# Altium project C210 Rev_D.PrjPcb (part 3 of 5)

## Sheet C210_0006_Power.SchDoc: C210_0006_Power
size B; Date: 2/26/2021; CompanyName: U-blox; DrawnBy: EMOO; Engineer: EMOO; Organization: U-blox; Address1: 2601 25th St. SE; Address2: Salem, OR 97302; SheetNumber: 6; SheetTotal: 7; Website: www.u-blox.com; SheetSize: B; SheetTitle: C-210 Power
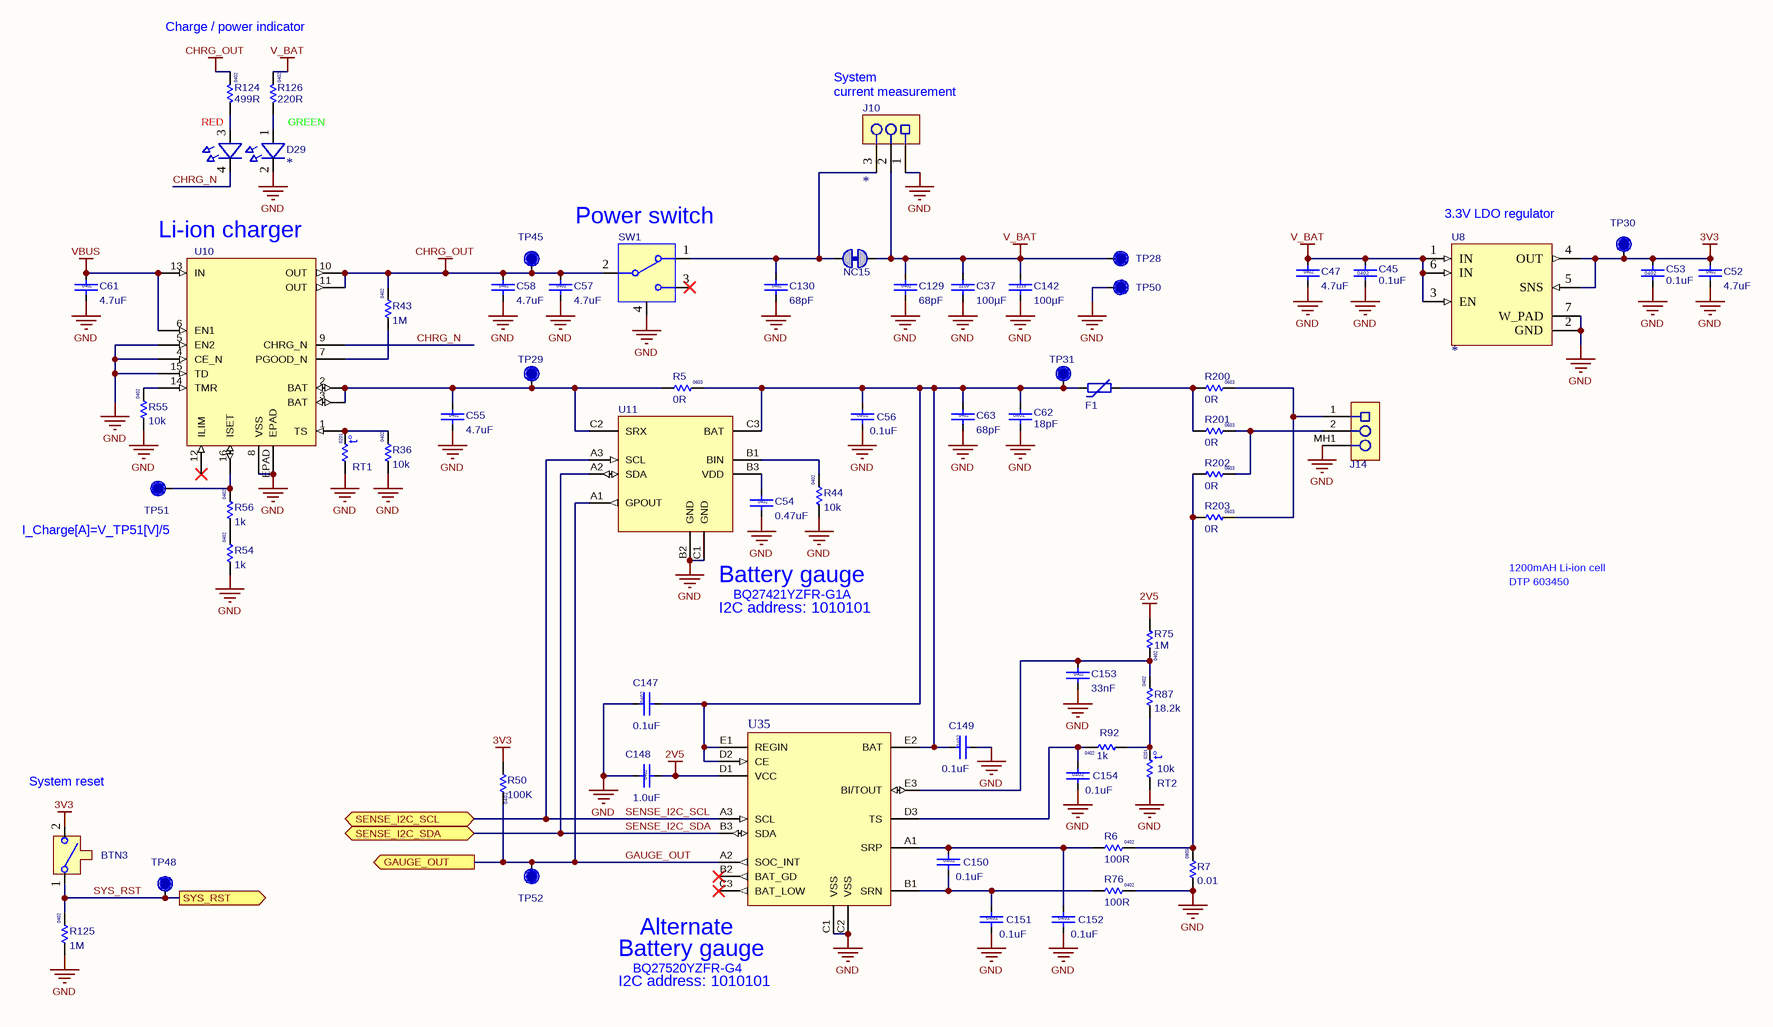
[diagram p3: C210_0006_Power.SchDoc]

### Parts
(Parts that share a designator on the sheet are numbered #1, #2 ... from top to bottom, then left to right.)
?#5  (no value)  (graphical)
BTN3  (no value)  [B3U-3000P]
C37  value 100µF  Size: 1210  [Cap 1210]
C45  value 0.1uF  Size: 0402  [Cap 0402 HD]  (hidden comment: 120-000160.1uF)
C47  value 4.7uF  Size: 0402  [Cap 0402 HD]
C52  value 4.7uF  Size: 0402  [Cap 0402 HD]
C53  value 0.1uF  Size: 0402  [Cap 0402 HD]  (hidden comment: 120-000160.1uF)
C54  value 0.47uF  Size: 0402  [Cap 0402 HD]
C55  value 4.7uF  Size: 0402  [Cap 0402 HD]
C56  value 0.1uF  Size: 0402  [Cap 0402 HD]  (hidden comment: 120-000160.1uF)
C57  value 4.7uF  Size: 0402  [Cap 0402 HD]
C58  value 4.7uF  Size: 0402  [Cap 0402 HD]
C61  value 4.7uF  Size: 0402  [Cap 0402 HD]
C62  value 18pF  Size: 0402  [Cap 0402 HD]
C63  value 68pF  Size: 0402  [Cap 0402 HD]
C129  value 68pF  Size: 0402  [Cap 0402 HD]
C130  value 68pF  Size: 0402  [Cap 0402 HD]
C142  value 100µF  Size: 1210  [Cap 1210]
C147  value 0.1uF  Size: 0402  [Cap 0402 HD]  (hidden comment: 120-000160.1uF)
C148  value 1.0uF  Size: 0402  [Cap 0402 HD]  (hidden comment: 120-000171.0uF)
C149  value 0.1uF  Size: 0402  [Cap 0402 HD]  (hidden comment: 120-000160.1uF)
C150  value 0.1uF  Size: 0402  [Cap 0402 HD]  (hidden comment: 120-000160.1uF)
C151  value 0.1uF  Size: 0402  [Cap 0402 HD]  (hidden comment: 120-000160.1uF)
C152  value 0.1uF  Size: 0402  [Cap 0402 HD]  (hidden comment: 120-000160.1uF)
C153  value 33nF  Size: 0402  [Cap 0402 HD]
C154  value 0.1uF  Size: 0402  [Cap 0402 HD]  (hidden comment: 120-000160.1uF)
D29  (no value)  [LED_4Pin_4213_RA_3215]
F1  (no value)  [Fuse 1206]
J10  (no value)  [HDR-0.1P-3Pin-1Row-SMT]
J14  (no value)  [S2B-PH-SM4-TB]
NC15  Solderbridge-ShortDNP  [Solderbridge-Short]  (value not drawn)  (net tie, no BOM)
R5  value 0R  Size: 0603  [RES 0603 HD]
R6  value 100R  Size: 0402  [RES 0402 HD]
R7  value 0.01  Size: 0805  [RES 0805]
R36  value 10k  Size: 0402  [RES 0402 HD]
R43  value 1M  Size: 0402  [RES 0402 HD]
R44  value 10k  Size: 0402  [RES 0402 HD]
R50  value 100K  Size: 0402  [RES 0402 HD]
R54  value 1k  Size: 0402  [RES 0402 HD]
R55  value 10k  Size: 0402  [RES 0402 HD]
R56  value 1k  Size: 0402  [RES 0402 HD]
R75  value 1M  Size: 0402  [RES 0402 HD]
R76  value 100R  Size: 0402  [RES 0402 HD]
R87  value 18.2k  Size: 0402  [RES 0402 HD]
R92  value 1k  Size: 0402  [RES 0402 HD]
R124  value 499R  Size: 0402  [RES 0402 HD]
R125  value 1M  Size: 0402  [RES 0402 HD]
R126  value 220R  Size: 0402  [RES 0402 HD]
R200  value 0R  Size: 0603  [RES 0603 HD]
R201  value 0R  Size: 0603  [RES 0603 HD]
R202  value 0R  Size: 0603  [RES 0603 HD]
R203  value 0R  Size: 0603  [RES 0603 HD]
RT1  Size: 0201  [RES 0201 HD]  (hidden comment: Res Thermal)
RT2  value 10k  Size: 0201  [RES 0201 HD]  (hidden comment: Res Thermal)
SW1  (no value)  [EG1224]
TP28  TP  [TP12R]  (value not drawn)  (no BOM)
TP29  TP  [TP12R]  (value not drawn)  (no BOM)
TP30  TP  [TP12R]  (value not drawn)  (no BOM)
TP31  TP  [TP12R]  (value not drawn)  (no BOM)
TP45  TP  [TP12R]  (value not drawn)  (no BOM)
TP48  TP  [TP12R]  (value not drawn)  (no BOM)
TP50  TP  [TP12R]  (value not drawn)  (no BOM)
TP51  TP  [TP12R]  (value not drawn)  (no BOM)
TP52  TP  [TP12R]  (value not drawn)  (no BOM)
U8  (no value)  [DFN0.95P-6Pin_W-Pad]
U10  bq24230  [QFN0.5P3x3-16Pin_W-Pad]  (value not drawn)
U11  (no value)  [BQ27421]
U35  (no value)  [BQ27520]

### Ports
GAUGE_OUT (out), SENSE_I2C_SCL (bidir), SENSE_I2C_SDA (bidir), SYS_RST (out)

### Nets
2V5: C148.2 R75.1 U35.D1(VCC)
3V3: BTN3.2 C52.1 C53.2 R50.1 TP30.1 U8.4(OUT) U8.5(SNS)
CHRG_OUT: C57.1 C58.1 R43.2 R124.2 SW1.2 TP45.1 U10.10(OUT) U10.11(OUT)
GND: C37.2 C45.1 C47.2 C52.2 C53.1 C54.2 C55.2 C56.1 C57.2 C58.2 C61.2 C62.1 C63.2 C129.2 C130.2 C142.2 C147.2 C148.1 C149.1 C151.1 C152.1 C153.2 C154.1 D29.2(C1) J10.1 J14.MH1 R7.1 R36.1 R44.1 R54.1 R55.1 R76.2 R125.1 RT1.2 RT2.2 SW1.4(GND) TP50.1 U8.2(GND) U8.7(W_PAD) U10.4(CE_N) U10.5(EN2) U10.8(VSS) U10.15(TD) U10.EPAD U11.B2(GND) U11.C1(GND) U35.C1(VSS) U35.C2(VSS)
V_BAT: C37.1 C45.2 C47.1 C129.1 C142.1 J10.2 NC15.1 R126.2 TP28.1 U8.1(IN) U8.3(EN) U8.6(IN)
VBUS: C61.1 U10.6(EN1) U10.13(IN)
CHRG_N: D29.4(C2) U10.9(CHRG_N)
GAUGE_OUT: R50.2 TP52.1 U11.A1(GPOUT) U35.A2(SOC_INT) ; port GAUGE_OUT
SENSE_I2C_SCL: U11.A3(SCL) U35.A3(SCL) ; port SENSE_I2C_SCL
SENSE_I2C_SDA: U11.A2(SDA) U35.B3(SDA) ; port SENSE_I2C_SDA
SYS_RST: BTN3.1 R125.2 TP48.1 ; port SYS_RST
NetC54_1: C54.1 U11.B3(VDD)
NetC55_1: C55.1 R5.1 TP29.1 U10.2(BAT) U10.3(BAT) U11.C2(SRX)
NetC56_2: C56.2 C62.2 C63.1 C147.1 C149.2 F1.1 R5.2 TP31.1 U11.C3(BAT) U35.D2(CE) U35.E1(REGIN) U35.E2(BAT)
NetC130_1: C130.1 J10.3 NC15.2 SW1.1
NetC150_1: C150.1 C151.2 R76.1 U35.B1(SRN)
NetC150_2: C150.2 C152.2 R6.1 U35.A1(SRP)
NetC153_1: C153.1 R75.2 R87.2 U35.E3(BI/TOUT)
NetC154_2: C154.2 R92.2 U35.D3(TS)
NetD29_1: D29.1(A1) R126.1
NetD29_3: D29.3(A2) R124.1
NetF1_2: F1.2 R200.1 R201.1
NetJ14_1: J14.1 R200.2 R203.2
NetJ14_2: J14.2 R201.2 R202.2
NetR6_2: R6.2 R7.2 R202.1 R203.1
NetR36_2: R36.2 RT1.1 U10.1(TS)
NetR43_1: R43.1 U10.7(PGOOD_N)
NetR44_2: R44.2 U11.B1(BIN)
NetR54_2: R54.2 R56.1
NetR55_2: R55.2 U10.14(TMR)
NetR56_2: R56.2 TP51.1 U10.16(ISET)
NetR87_1: R87.1 R92.1 RT2.1

Not connected (* = marked no-connect by the designer): SW1 3*; U10 12(ILIM)*; U35 B2(BAT_GD)* C3(BAT_LOW)*

### Notes on the sheet
- Charge / power indicator
- System
- RED
- GREEN
- (near J10) current measurement
- (near SW1) Power switch
- (near U8) 3.3V LDO regulator
- (near U10) Li-ion charger
- (near TP51) I_Charge[A]=V_TP51[V]/5
- (near U11) Battery gauge
- DTP 603450
- 1200mAH Li-ion cell
- I2C address: 1010101
- BQ27421YZFR-G1A
- (near BTN3) System reset
- (near U35) Alternate
- (near U35) Battery gauge
- BQ27520YZFR-G4
- Revision:
- Page:
- (in symbol 182-00002) t°

### Library data of the parts
?#5 = Sub_Title_Block: Minimized schematic title block for all subset sheets
BTN3 = 135-00006: Button SPST-NO Off-MOM, 50mA 12V, Right Angle, SMT; Manufacturer 1: Omron Electronics Inc-EMC Div; Part Name: Button Tactile SPST-NO 50mA 3mm RA SMT; Body Size: 3.00mm x 2.50mm; Item Phase: In Production; Use in new designs: Yes; Voltage: 12VDC; UBX Code: None; Part Number: 135-00006; Manufacturer Part Number 1: B3U-3000P; Supplier 1: Digi-Key; Supplier Part Number 1: SW1022CT-ND; Current: 50mA; Height: 1.35mm; Max Operating Temp: 70; Min Operating Temp: -25; Pins: 2; Revision: 0A; Manufacturer 2: None; Manufacturer Part Number 2: None; Supplier 2: None; Supplier Part Number 2: None
C37 C142 = 120-00223: 100µF ±20% 10V Ceramic Capacitor X5R 1210 (3225 Metric); Manufacturer 1: Samsung Electro-Mechanics America, Inc.; Manufacturer Part Number 1: CL32A107MPVNNNE; Part Name: CAP CER 100UF 10V 20% X5R 1210; Item Phase: In Production; Tolerance: +/- 20%; Use in new designs: Yes; UBX Code: None; Part Number: 120-00223; Supplier 1: Future Electronics; Supplier Part Number 1: Samsung Electro-Mechanics America, Inc. CL32A107MPVNNNE; Manufacturer 2: None; Manufacturer Part Number 2: None; Supplier 2: None; Supplier Part Number 2: None; Height: 2.8mm; Max Operating Temp: 85; Min Operating Temp: -55; Pins: 2; Revision: 0A; Temperature Coefficient: X5R; Voltage: 10V
C45 C53 C56 C147 C149-C152 C154 = 120-00016: Cap, Ceramic 0.1uF 10V 10% X5R 0402; Part Name: CAP CER 0.1UF 10V 10% X5R 0402; Part_Type: Ceramic Capacitor; Manufacturer: Murata Electronics North America; Manufacturer P/N: GRM155R61A104KA01J; Item_Phase: Production; Component Mounting Type: SMT; Tolerance: +/- 10%; Use in new designs: Yes; Part Number: 120-00016; Revision: 0A; Supplier 1: Digi-Key; Supplier Part Number 1: 490-6297-1-ND; Manufacturer 2: Yageo; Manufacturer P/N 2: CC0402KRX5R6BB104; Supplier 2: Digi-Key; Supplier Part Number 2: 311-1336-1-ND; Arena Link: https://app.bom.com/a/GYHPV2L2L43KRMBK?v=spec.summary; Height: 0.55mm; Pins: 2; Temperature Coefficient: X5R; Voltage: 10V
C47 C52 C55 C57 C58 C61 = 120-00020: Cap, Ceramic 4.7uF 10V 20% X5R 0402; Manufacturer 1: Samsung Electro-Mechanics America, Inc; Manufacturer Part Number 1: CL05A475MP5NRNC; Part Name: CAP CER 4.7uF 10V 20% X5R 0402; Item Phase: In Production; Tolerance: +/- 20%; Use in new designs: Yes; UBX Code: None; Part Number: 120-00020; Supplier 1: Digi-Key; Supplier Part Number 1: 1276-1482-1-ND; Manufacturer 2: Yageo; Manufacturer Part Number 2: CC0402KRX5R6BB475; Supplier 2: Digi-Key; Supplier Part Number 2: 311-3477-1-ND; Height: 0.55mm; Max Operating Temp: 85; Min Operating Temp: -55; Pins: 2; Revision: 0C; Temperature Coefficient: X5R; Voltage: 10V
C54 = 120-00072: Cap, Ceramic, 0.47UF 10V 10% X5R 0402; Manufacturer 1: Murata Electronics North America; Manufacturer Part Number 1: GRM155R61A474KE15J; Part Name: CAP CER 0.47UF 10V 10% X5R 0402; Item Phase: In Production; Tolerance: +/- 10%; Use in new designs: Yes; UBX Code: None; Part Number: 120-00072; Supplier 1: Digi-Key; Supplier Part Number 1: 490-6305-1-ND; Manufacturer 2: Samsung Electro-Mechanics America, Inc; Manufacturer Part Number 2: CL05A474KP5NNNC; Supplier 2: Digi-Key; Supplier Part Number 2: 1276-1173-1-ND; Height: 0.55mm; Max Operating Temp: 85; Min Operating Temp: -55; Pins: 2; Revision: 0A; Temperature Coefficient: X5R; Voltage: 10V
C62 = 120-00041: Cap, Ceramic 18pF 50V 5% NP0 0402; Manufacturer 1: NIC Components Inc; Manufacturer Part Number 1: NMC0402NPO180J50TRPF; Part Name: CAP CER 18PF 50V 5% NP0 0402; Item Phase: In Production; Tolerance: +/- 5%; Use in new designs: Yes; UBX Code: None; Part Number: 120-00041; Supplier 1: Arrow; Supplier Part Number 1: NMC0402NPO180J50TRPF; Manufacturer 2: CCK; Manufacturer Part Number 2: CCK0402NPO5J180PL; Supplier 2: None; Supplier Part Number 2: None; Height: 0.55mm; Max Operating Temp: 125; Min Operating Temp: -55; Pins: 2; Revision: 0C; Temperature Coefficient: NP0; Voltage: 50V
C63 C129 C130 = 120-00047: Cap, Ceramic, 68pF, 50V, 1%, NP0, 0402; Manufacturer 1: Murata Electronics North America; Manufacturer Part Number 1: GRM1555C1H680FA01D; Part Name: CAP CER 68PF 50V 1% NP0 0402; Item Phase: Unreleased; Tolerance: +/- 1%; Use in new designs: Yes; UBX Code: None; Part Number: 120-00047; Supplier 1: Digi-Key; Supplier Part Number 1: 490-8219-1-ND; Manufacturer 2: AVX Corporation; Manufacturer Part Number 2: 04025A680FAT2A; Supplier 2: Digi-Key; Supplier Part Number 2: 478-7881-1-ND; Height: 0.55mm; Max Operating Temp: 125; Min Operating Temp: -55; Pins: 2; Revision: None; Temperature Coefficient: NP0; Voltage: 50V
C148 = 120-00017: Cap, Ceramic, 1.0uF 10V 10% X5R, 0402; Part Name: CAP CER 1UF 10V 10% X5R 0402; Part_Type: Ceramic Capacitor; Manufacturer: Murata Electronics North America; Manufacturer P/N: GRM155R61A105KE15D; Item_Phase: Production; Component Mounting Type: SMT; Tolerance: +/- 10%; Use in new designs: Yes; Part Number: 120-00017; Revision: 0A; Supplier 1: Digi-Key; Supplier Part Number 1: 490-3890-1-ND; Manufacturer 2: TDK Corporation; Manufacturer P/N 2: C1005X5R1A105K050BB; Supplier 2: Digi-Key; Supplier Part Number 2: 445-4114-1-ND; Arena Link: https://app.bom.com/a/1J2AGN6N6PO5C7V9?v=spec.summary; Height: 0.55mm; Pins: 2; Temperature Coefficient: X5R; Voltage: 10V
C153 = 120-00080: Cap, Ceramic 33nF 16V 10% X7R 0402; Manufacturer 1: Yageo; Manufacturer Part Number 1: CC0402KRX7R7BB333; Part Name: CAP CER 33nF 16V 10% X7R 0402; Item Phase: In Production; Tolerance: +/- 10%; Use in new designs: Yes; UBX Code: None; Part Number: 120-00080; Supplier 1: Digi-Key; Supplier Part Number 1: 311-1420-1-ND; Manufacturer 2: TDK Corporation; Manufacturer Part Number 2: CGA2B2X7R1C333K050BA; Supplier 2: Digi-Key; Supplier Part Number 2: 445-12238-1-ND; Height: 0.55mm; Max Operating Temp: 125; Min Operating Temp: -55; Pins: 2; Revision: 0A; Temperature Coefficient: X7R; Voltage: 16V
D29 = 115-00013: Dual LED, Red/Green, Right Angle, Dome 1208; Manufacturer 1: Dialight; Manufacturer Part Number 1: 5988510207F; Part Name: LED Red/Green RA SMT 1208; Body Size: 3.2mm x 1.5mm; Current: 20mA; Item Phase: In Production; MFG Package: 1208 Bi-color; Use in new designs: Yes; Voltage: None; Color: *; Part Number: 115-00013; Supplier 1: Digi-Key; Supplier Part Number 1: 350-2072-1-ND; Height: 1.0mm; Max Operating Temp: None; Min Operating Temp: None; Pins: 4; Revision: 0A; Size: None; UBX Code: None; Manufacturer 2: None; Manufacturer Part Number 2: None; Supplier 2: None; Supplier Part Number 2: None
F1 = 190-00005: Fuse, PTC 8V, 750mA, hold, 1.5A trip, 1206; Manufacturer 1: Littelfuse; Manufacturer Part Number 1: 1206L075THYR; Part Name: Fuse PTC 8V 750mA 1206; Body Size: None; Item Phase: Unreleased; MFG Package: 1206L; Use in new designs: Yes; Part Number: 190-00005; Supplier 1: Digi-Key; Supplier Part Number 1: F3370CT-ND; Current: 750mA; Height: 0.75mm; Max Operating Temp: 85; Min Operating Temp: -40; Pins: 2; Revision: None; Size: 1206; Voltage: None; UBX Code: None
J10 = 130-00105: Header, 0.100" Pitch, 3 Pin, Vertical SMT, Black; Manufacturer 1: Harwin Inc; Manufacturer Part Number 1: M20-8770342; Part Name: CON HDR 0.1" 3 Pin 1 Row SMT; Item Phase: In Production; Use in new designs: Yes; Voltage: None; Manufacturer P/N: *; Part Number: 130-00105; Supplier 1: Digi-Key; Supplier Part Number 1: 952-1951-ND; Diameter: None; Height: 9.93mm; Max Operating Temp: None; Min Operating Temp: None; Pins: 3; Revision: 0C; UBX Code: None; Manufacturer 2: Greenconn Corporation; Manufacturer Part Number 2: GPHC1010302A081B1BD; Supplier 2: Teamwise Limited; Supplier Part Number 2: Greenconn Corporation GPHC1010302A081B1BD
J14 = S2B-PH-SM4-TB: Conn, SMT, 0.079" Pitch, 2 Pin, R/A, Black; Item Phase: In Production; Use in new designs: Yes; Voltage: None; Part Number: S2B-PH-SM4-TB; Manufacturer Part Number 1: S2B-PH-SM4-TB; Supplier 1: None; Supplier Part Number 1: None; Diameter: None; Height: 5.5mm; Max Operating Temp: None; Min Operating Temp: None; Part Name: Conn, SMT, 0.079" Pitch, 2 Pin, R/A, Black; Pins: 2; Revision: 0A; UBX Code: None; Manufacturer 2: None; Manufacturer Part Number 2: None; Supplier 2: None; Supplier Part Number 2: None; Manufacturer P/N: *
NC15 = Solderbridge-Short: Added By: Paul B; Part Number: Solderbridge-Short; Height: 0; DNP: DNP; Added Date: 12/2/2015
R5 R200-R203 = 180-00012: Resistor 0 ohm Jumper, 1/10W, 0603; Manufacturer 1: Hong Kong Resistors Manufactory; Manufacturer Part Number 1: RCT030RLF; Part Name: RES SMD 0.0 OHM JUMPER 1/10W 0603; Item Phase: In Production; Tolerance: None; Use in new designs: Yes; Part Number: 180-00012; Supplier 1: None; Supplier Part Number 1: None; Manufacturer 2: Samsung Electro-Mechanics America, Inc; Manufacturer Part Number 2: RC1608J000CS; Supplier 2: Digi-Key; Supplier Part Number 2: 1276-3510-1-ND; Height: 0.55mm; Max Operating Temp: 155; Min Operating Temp: -55; Pins: 2; Power: 1/10W; Revision: 0D; Voltage: None; UBX Code: None
R6 R76 = 180-00051: Resistor, 100ohm, 1%, 1/16W, 0402.; Manufacturer 1: Hong Kong Resistors Manufactory; Manufacturer Part Number 1: RCT02100RFLF; Part Name: RES SMD 100 OHM 1% 1/16W 0402; Item Phase: In Production; Tolerance: +/- 1%; Use in new designs: Yes; Voltage: None; Part Number: 180-00051; Supplier 1: None; Supplier Part Number 1: None; Manufacturer 2: Stackpole Electronics Inc.; Manufacturer Part Number 2: RMCF0402FT100R; Supplier 2: Digi-Key; Supplier Part Number 2: RMCF0402FT100RCT-ND; Height: 0.4mm; Max Operating Temp: 155; Min Operating Temp: -55; Pins: 2; Power: 1/16W; Revision: 0E; UBX Code: None
R7 = 180-00150: Resistor, 0.01 ohm 1% 1/2W, 0805; Manufacturer 1: Stackpole Electronics Inc; Manufacturer Part Number 1: CSS0805FT10L0; Part Name: RES SMD 0.01 OHM 1% 1/2W 0805; Item Phase: Unreleased; Tolerance: +/- 1%; Use in new designs: Yes; Voltage: None; Manufacturer 2: Susumu; Manufacturer Part Number 2: KRL1220E-M-R010-F-T5; Height: 0.75mm; Max Operating Temp: 125; Min Operating Temp: -55; Pins: 2; Power: 1/2W; Revision: None; UBX Code: None
R36 R44 R55 = 180-00024: Resistor 10k ohm 1% 1/16W, 0402; Manufacturer 1: Samsung Electro-Mechanics America, Inc; Manufacturer Part Number 1: RC1005F103CS; Part Name: RES SMD 10K OHM 1% 1/16W 0402; Item Phase: In Production; Tolerance: +/- 1%; Use in new designs: Yes; UBX Code: None; Part Number: 180-00024; Supplier 1: Digi-Key; Supplier Part Number 1: 1276-3431-1-ND; Manufacturer 2: Hong Kong Resistors Manufactory; Manufacturer Part Number 2: RCT0210KFLF; Supplier 2: None; Supplier Part Number 2: None; Height: 0.4mm; Max Operating Temp: 155; Min Operating Temp: -55; Pins: 2; Power: 1/16W; Revision: 0E; Voltage: N/A
R43 R75 R125 = 180-00054: Resistor 1M ohm 1%, 1/16W, 0402; Manufacturer 1: Samsung Electro-Mechanics America, Inc; Manufacturer Part Number 1: RC1005F105CS; Part Name: RES SMD 1M OHM 1% 1/16W 0402; Item Phase: In Production; Tolerance: +/- 1%; Use in new designs: Yes; Voltage: None; Part Number: 180-00054; Supplier 1: Digi-Key; Supplier Part Number 1: 1276-3433-1-ND; Manufacturer 2: Hong Kong Resistors Manufactory; Manufacturer Part Number 2: RCT021MFLF; Supplier 2: None; Supplier Part Number 2: None; Height: 0.4mm; Max Operating Temp: 155; Min Operating Temp: -55; Pins: 2; Power: 1/16W; Revision: 0D; UBX Code: None
R50 = 180-00093: Resistor 100K ohm 1% 1/16W, 0402; Manufacturer 1: Yageo; Manufacturer Part Number 1: RC0402FR-07100KL; Part Name: RES SMD 100K ohm 1% 1/16W 0402; Item Phase: In Production; Tolerance: +/- 1%; Use in new designs: Yes; Voltage: None; Part Number: 180-00093; Supplier 1: Digi-Key; Supplier Part Number 1: 311-100KLRCT-ND; Manufacturer 2: Rohm Semiconductor; Manufacturer Part Number 2: MCR01MRTF1003; Supplier 2: Digi-Key; Supplier Part Number 2: RHM100KCDCT-ND; Height: 0.4mm; Max Operating Temp: 155; Min Operating Temp: -55; Pins: 2; Power: 1/16W; Revision: 0B; UBX Code: None
R54 R56 R92 = 180-00021: Resistor 1k ohm 1% 1/16W, 0402; Manufacturer 1: Hong Kong Resistors Manufactory; Manufacturer Part Number 1: RCT021KFLF; Part Name: RES SMD 1K OHM 1% 1/16W 0402; Item Phase: In Production; Tolerance: +/- 1%; Use in new designs: Yes; Voltage: None; Part Number: 180-00021; Supplier 1: None; Supplier Part Number 1: None; Manufacturer 2: Yageo; Manufacturer Part Number 2: RC0402FR-071KL; Supplier 2: Digi-Key; Supplier Part Number 2: 311-1.00KLRCT-ND; Height: 0.4mm; Max Operating Temp: 155; Min Operating Temp: -55; Pins: 2; Power: 1/16W; Revision: 0E; UBX Code: None
R87 = 180-00133: Resistor, 18.2KOhm, 1%, 1/16W, 0402; Manufacturer 1: Stackpole Electronics Inc; Manufacturer Part Number 1: RMCF0402FT18K2; Part Name: RES SMD 18.2K Ohm 1% 1/16W 0402; Item Phase: In Production; Tolerance: +/- 1%; Use in new designs: Yes; Voltage: None; Manufacturer 2: Bourns Inc.; Manufacturer Part Number 2: CR0402-FX-1822GLF; Height: 0.4mm; Max Operating Temp: 155; Min Operating Temp: -55; Pins: 2; Power: 1/16W; Revision: 0C; UBX Code: None
R124 = 180-00031: Resistor, 499ohm, 1%, 1/16W, 0402; Part Name: RES SMD 499 OHM 1% 1/16W 0402; Manufacturer: Rohm Semiconductor; Manufacturer P/N: MCR01MRTF4990; Item_Phase: Production; Component Mounting Type: SMT; Tolerance: +/- 1%; Use in new designs: Yes; Part Number: 180-00031; Part_Type: Resistor; Supplier 1: Digi-Key; Supplier Part Number 1: RHM499CDCT-ND; Manufacturer 2: Samsung Electro-Mechanics America, Inc; Manufacturer P/N 2: RC1005F4990CS; Arena Link: https://app.bom.com/a/Q8RZ5CVCVEDU1SS5?v=spec.summary; Height: 0.4mm; Pins: 2; Power: 1/16W; Revision: 0D; Supplier 2: Digi-Key; Supplier Part Number 2: 1276-3992-1-ND; Alternate Footprint Ref: RES 0402
R126 = 180-00098: Resistor, 220ohm, 5%, 1/16W, 0402.; Part Name: RES SMD 220 OHM 5% 1/16W 0402; Manufacturer: Panasonic Electronic Components; Manufacturer P/N: ERJ-2GEJ221X; Item_Phase: Production; Component Mounting Type: SMT; Tolerance: +/- 5%; Use in new designs: Yes; Part Number: 180-00098; Part_Type: Resistor; Supplier 1: Digi-Key; Supplier Part Number 1: P220JCT-ND; Arena Link: https://app.bom.com/a/8Q9HNUDUDWVBJC30?v=spec.summary; Pins: 2; Power: 1/16W; Revision: 0C; Manufacturer 2: Samsung Electro-Mechanics America, Inc; Manufacturer P/N 2: RC1005J221CS; Supplier 2: Digi-Key; Supplier Part Number 2: 1276-4360-1-ND; Alternate Footprint Ref: RES 0402; Height: 0.4mm
RT1 = 182-00002: Thermistor, 10Kohm, NTC 5%, 0201, 0.6mm x 0.3mm; Manufacturer 1: Murata Electronics North America; Manufacturer Part Number 1: NCP03XH103J05RL; Part Name: Thermistor 10k Ohm 5% 3380K 0201; Item Phase: Unreleased; Power: 1/20W; Tolerance: +/- 5%; Use in new designs: Yes; Value: 10k; Voltage: None; Part Number: 182-00002; Supplier 1: Digi-Key; Supplier Part Number 1: 490-4644-1-ND; Body Size: 0.6mm x 0.3mm; Height: 0.26mm; Max Operating Temp: 125; Min Operating Temp: -40; Pins: 2; Revision: None; UBX Code: None
RT2 = 182-00002: Thermistor, 10Kohm, NTC 5%, 0201, 0.6mm x 0.3mm; Manufacturer 1: Murata Electronics North America; Manufacturer Part Number 1: NCP03XH103J05RL; Part Name: Thermistor 10k Ohm 5% 3380K 0201; Item Phase: Unreleased; Power: 1/20W; Tolerance: +/- 5%; Use in new designs: Yes; Voltage: None; Part Number: 182-00002; Supplier 1: Digi-Key; Supplier Part Number 1: 490-4644-1-ND; Body Size: 0.6mm x 0.3mm; Height: 0.26mm; Max Operating Temp: 125; Min Operating Temp: -40; Pins: 2; Revision: None; UBX Code: None
SW1 = 137-00002: Slide switch, SPDT, 3 Pin, 500mA, 15V, Through Hole; Manufacturer 1: E-Switch; Part Name: Switch Slide SPDT 500mA 13.8mm RA TH; Item Phase: Unreleased; Use in new designs: Yes; UBX Code: None; Part Number: 137-00002; Manufacturer Part Number 1: EG1224; Supplier 1: Digi-Key; Supplier Part Number 1: EG2585-ND; Current: 500mA; Height: 8.5mm; Max Operating Temp: 70; Min Operating Temp: -20; Pins: 3; Revision: None; Voltage: 15V; Manufacturer 2: None; Manufacturer Part Number 2: None; Supplier 2: None; Supplier Part Number 2: None
TP28-TP31 TP45 TP48 TP50-TP52 = TP_R: Testpoint, Round 1.0mm Dia; Part Number: TP10R; Added By: Jeremy D; Size: 1.0mm; Height: 0; DNP: DNP; Added Date: 2/1/2015; Checked By: Paul B; Checked Date: 2/5/2015
U8 = 260-00045: IC REG LDO 3.3V 1A 6DFN; Manufacturer 1: ON Semiconductor; Body Size: 3mm x 3mm; Item Phase: Unreleased; Reg Outputs: None; MFG Package: 6-VDFN Exposed Pad; SMT Pitch: 0.95mm; Thermal Pad: Yes; Manufacturer P/N: *; Part Number: 260-00045; Manufacturer Part Number 1: NCP692MN33T2G; Supplier 1: Digi-Key; Supplier Part Number 1: NCP692MN33T2GOSTR-ND; Current: 1A; Height: 1mm; Max Operating Temp: 85; Min Operating Temp: -40; Part Name: NCP692MN33T2G; Pins: 6; Revision: None; Use in new designs: Yes; Voltage: 3.3V; UBX Code: None; Manufacturer 2: ON Semiconductor; Manufacturer Part Number 2: NCV8690MN33T2G; Supplier 2: None; Supplier Part Number 2: None
U10 = bq24230: BAT CHARGER, Li-ION, SMT, USB, PWR PATH, 500mA, 4.4V, 3mmx3mm QFN-16; Manufacturer 1: Texas Instruments; Manufacturer Part Number 1: BQ24230RGTR; Body Size: 3.3mm x 3.3mm; Item Phase: Unreleased; MFG Package: VQFN-16; SMT Pitch: 0.5mm; Use in new designs: Yes; Voltage: 5-6.5V; UBX Code: None; Part Number: bq24230; Supplier 1: Digi-key; Supplier Part Number 1: 296-23937-2-ND; Height: 1mm; Max Operating Temp: 85; Min Operating Temp: -40; Pins: 16; Revision: None; Size: Other; Manufacturer 2: Texas Instruments; Manufacturer Part Number 2: BQ24230RGTT; Supplier 2: None; Supplier Part Number 2: None
U11 = BQ27421: IC, SMT, BATTERY GAUGE, INGLE CELL Li-ION, COULOMB COUNTER, DSBGA-9 1.6mmX1.6mm; Part Number: BQ27421YZFR-G1A; Manufacturer 1: Texas Instruments; Body Size: 1.4mm x 1.1mm; Current: None; Item Phase: In Production; MFG Package: QCS5P; Use in new designs: Yes; Manufacturer Part Number 1: BQ27421YZFR-G1A; Manufacturer 2: Texas Instruments; Manufacturer Part Number 2: BQ27421YZFT-G1A; Height: 0.45mm; Max Operating Temp: 85; Min Operating Temp: -40; Pins: 9; Revision: 0A; Voltage: N/A; UBX Code: None
U35 = BQ27520: IC, SMT, BATTERY GAUGE, INGLE CELL Li-ION, COULOMB COUNTER, DSBGA-15 2.6mmX2.0mm; Part Number: BQ27520YZFR-G4; Manufacturer 1: Texas Instruments; Part Name: BQ27520-G4; Current: None; Item Phase: In Production; Use in new designs: Yes; Manufacturer Part Number 1: BQ27520YZFR-G4; Manufacturer 2: Texas Instruments; Manufacturer Part Number 2: BQ27520YZFR-G3; Body Size: 2.6mm x 2.0mm; Height: 0.65mm; MFG Package: DSBGA-15; Max Operating Temp: 85; Min Operating Temp: -40; Pins: 15; Revision: 0A; Voltage: N/A; UBX Code: None

## Sheet C210_0007_Sensors.SchDoc: C210_0007_Sensors
size B; Date: 2/26/2021; CompanyName: U-blox; DrawnBy: EMOO; Engineer: EMOO; Organization: U-blox; Address1: 2601 25th St. SE; Address2: Salem, OR 97302; SheetNumber: 7; SheetTotal: 7; Website: www.u-blox.com; SheetSize: B; SheetTitle: C-210 Sensors
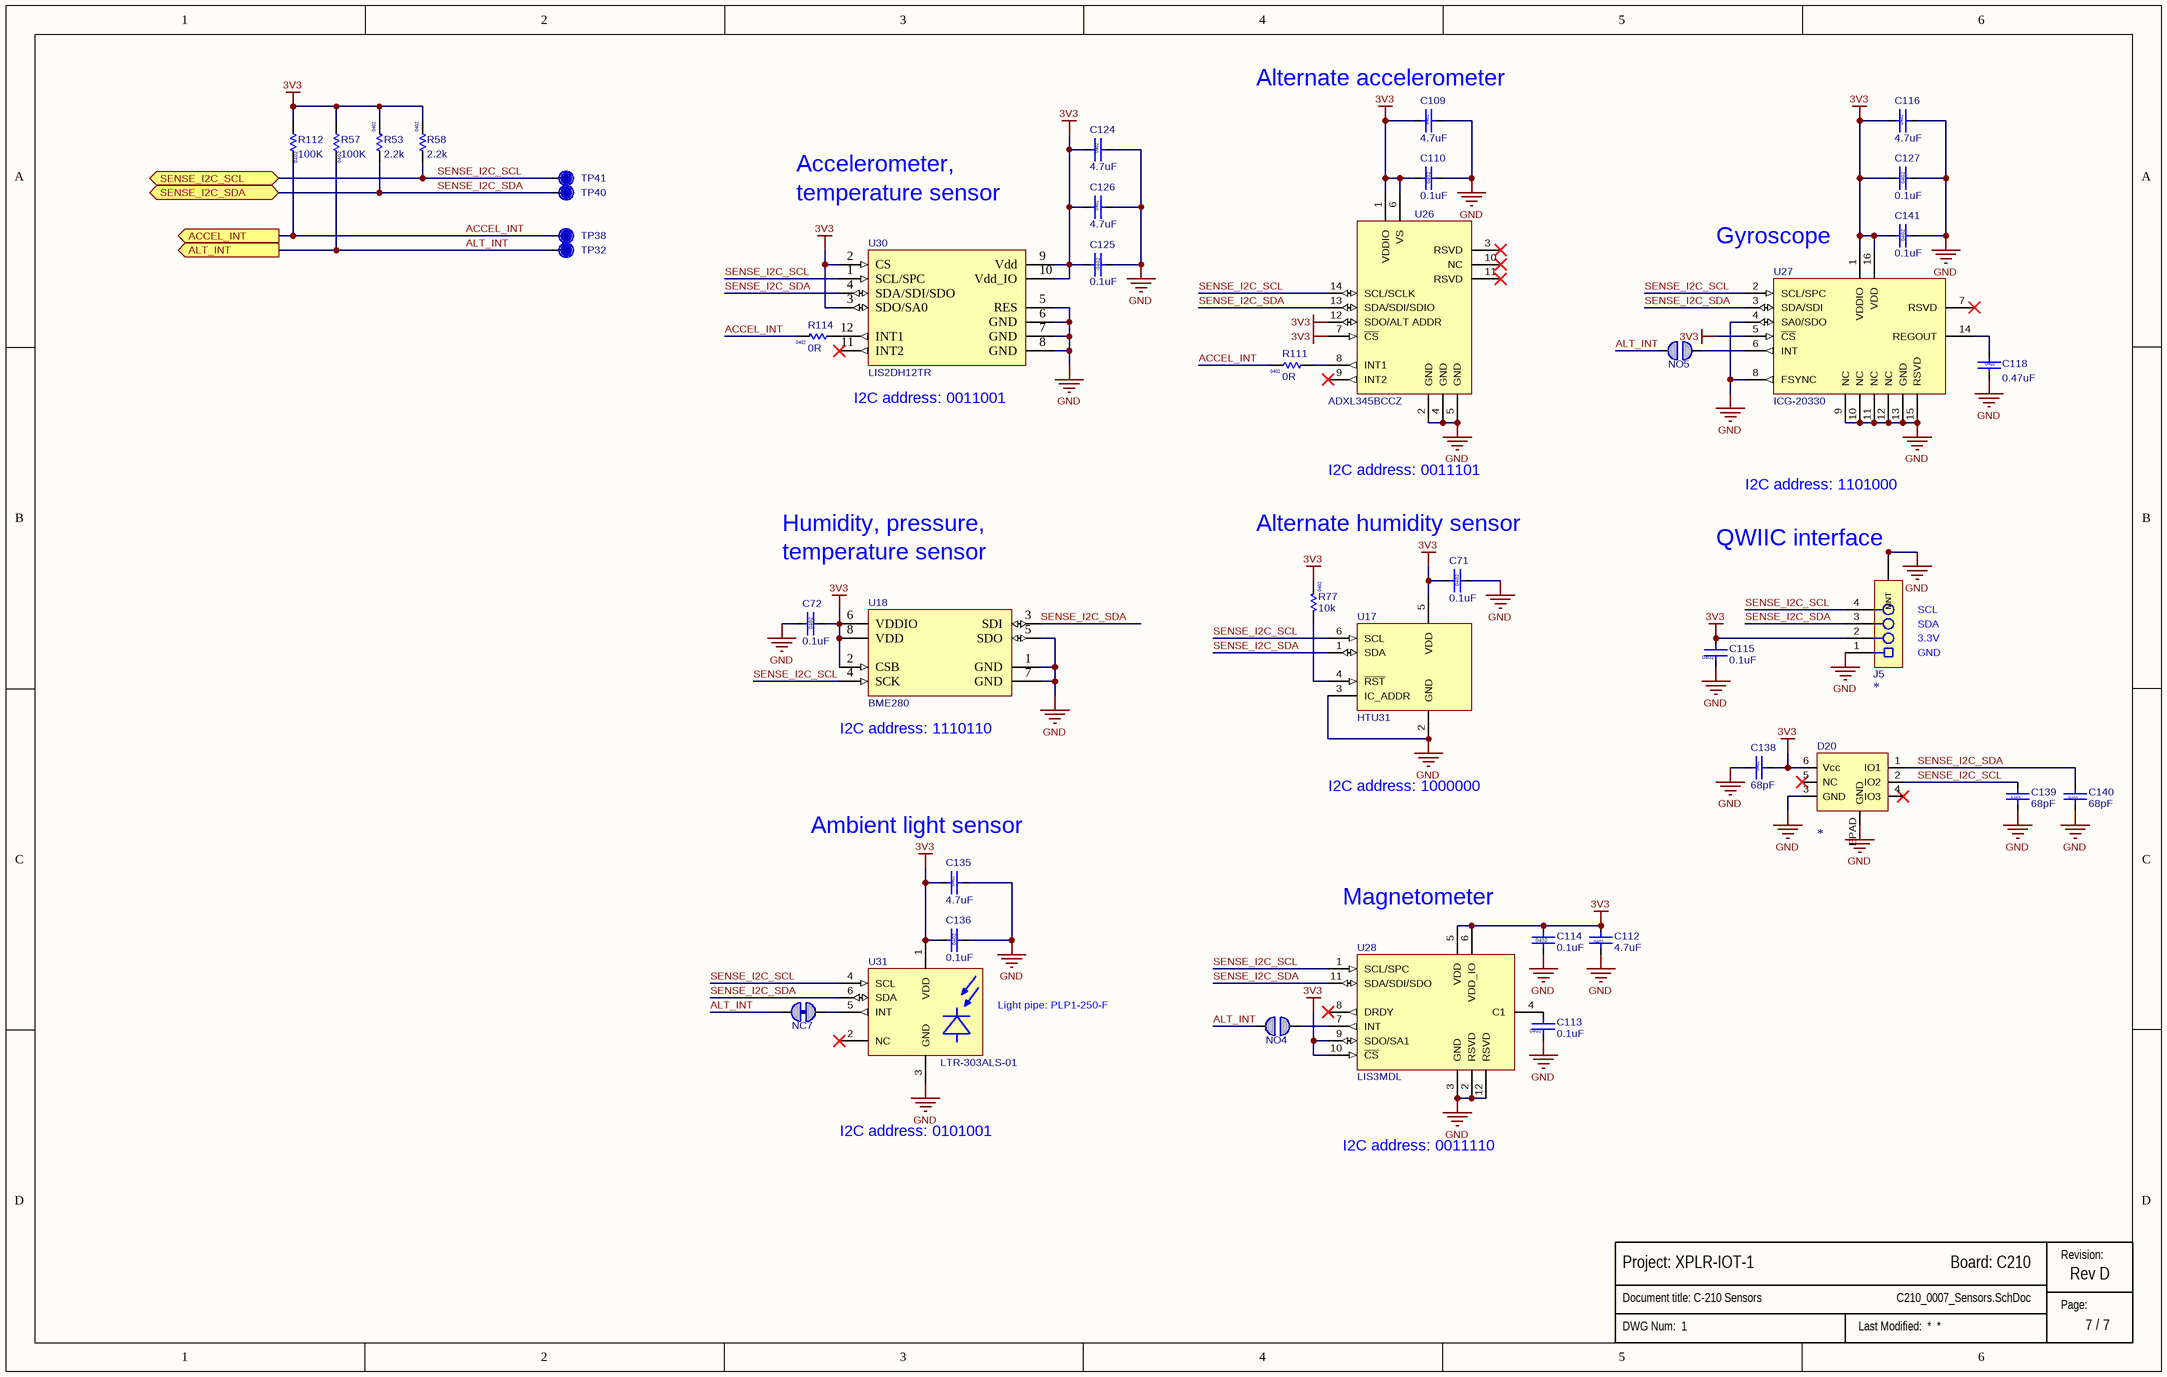
[diagram p4: C210_0007_Sensors.SchDoc]

### Parts
(Parts that share a designator on the sheet are numbered #1, #2 ... from top to bottom, then left to right.)
?#6  (no value)  (graphical)
C71  value 0.1uF  Size: 0402  [Cap 0402 HD]  (hidden comment: 120-000160.1uF)
C72  value 0.1uF  Size: 0402  [Cap 0402 HD]  (hidden comment: 120-000160.1uF)
C109  value 4.7uF  Size: 0402  [Cap 0402 HD]
C110  value 0.1uF  Size: 0402  [Cap 0402 HD]  (hidden comment: 120-000160.1uF)
C112  value 4.7uF  Size: 0402  [Cap 0402 HD]
C113  value 0.1uF  Size: 0402  [Cap 0402 HD]  (hidden comment: 120-000160.1uF)
C114  value 0.1uF  Size: 0402  [Cap 0402 HD]  (hidden comment: 120-000160.1uF)
C115  value 0.1uF  Size: 0402  [Cap 0402 HD]  (hidden comment: 120-000160.1uF)
C116  value 4.7uF  Size: 0402  [Cap 0402 HD]
C118  value 0.47uF  Size: 0402  [Cap 0402 HD]
C124  value 4.7uF  Size: 0402  [Cap 0402 HD]
C125  value 0.1uF  Size: 0402  [Cap 0402 HD]  (hidden comment: 120-000160.1uF)
C126  value 4.7uF  Size: 0402  [Cap 0402 HD]
C127  value 0.1uF  Size: 0402  [Cap 0402 HD]  (hidden comment: 120-000160.1uF)
C135  value 4.7uF  Size: 0402  [Cap 0402 HD]
C136  value 0.1uF  Size: 0402  [Cap 0402 HD]  (hidden comment: 120-000160.1uF)
C138  value 68pF  Size: 0402  [Cap 0402 HD]
C139  value 68pF  Size: 0402  [Cap 0402 HD]
C140  value 68pF  Size: 0402  [Cap 0402 HD]
C141  value 0.1uF  Size: 0402  [Cap 0402 HD]  (hidden comment: 120-000160.1uF)
D20  (no value)  [TPD3E001DRSR]
J5  (no value)  [SM04B-SRSS-TB(LF)(SN)]
NC7  Solderbridge-ShortDNP  [Solderbridge-Short]  (value not drawn)  (net tie, no BOM)
NO4  Solderbridge-OpenDNP  [Solderbridge-Open]  (value not drawn)  (no BOM)
NO5  Solderbridge-OpenDNP  [Solderbridge-Open]  (value not drawn)  (no BOM)
R53  value 2.2k  Size: 0402  [RES 0402 HD]
R57  value 100K  Size: 0402  [RES 0402 HD]
R58  value 2.2k  Size: 0402  [RES 0402 HD]
R77  value 10k  Size: 0402  [RES 0402 HD]
R111  value 0R  Size: 0402  [RES 0402 HD]
R112  value 100K  Size: 0402  [RES 0402 HD]
R114  value 0R  Size: 0402  [RES 0402 HD]
TP32  TP  [TP12R]  (value not drawn)  (no BOM)
TP38  TP  [TP12R]  (value not drawn)  (no BOM)
TP40  TP  [TP12R]  (value not drawn)  (no BOM)
TP41  TP  [TP12R]  (value not drawn)  (no BOM)
U17  (no value)  [HTU31]
U18  (no value)  [DFN0.65P-8Pin]
U26  Manufacturer Part Number 1: ADXL345BCCZ  [ADXL345]
U27  (no value)  [ICG-20330]
U28  (no value)  [LIS3MDL]
U30  Manufacturer P/N: LIS2DH12TR  [LGA0.5P_4x4_12Pin]
U31  (no value)  [LTR-303ALS-01]

### Ports
ACCEL_INT (out), ALT_INT (out), SENSE_I2C_SCL (bidir), SENSE_I2C_SDA (bidir)

### Nets
3V3: C71.1 C72.2 C109.1 C110.1 C112.2 C114.2 C115.2 C116.1 C124.1 C125.1 C126.1 C127.1 C135.1 C136.1 C138.2 C141.1 D20.6(Vcc) J5.2 R53.2 R57.1 R58.2 R77.2 R112.1 U17.5(VDD) U18.2(CSB) U18.6(VDDIO) U18.8(VDD) U26.1(VDDIO) U26.6(VS) U26.7(~{CS}) U26.12(SDO/ALT_ADDR) U27.1(VDDIO) U27.5(~{CS}) U27.16(VDD) U28.5(VDD) U28.6(VDD_IO) U28.9(SDO/SA1) U28.10(~{CS}) U30.2(CS) U30.3(SDO/SA0) U30.9(Vdd) U30.10(Vdd_IO) U31.1(VDD)
GND: C71.2 C72.1 C109.2 C110.2 C112.1 C113.1 C114.1 C115.1 C116.2 C118.2 C124.2 C125.2 C126.2 C127.2 C135.2 C136.2 C138.1 C139.1 C140.1 C141.2 D20.3(GND) D20.EPAD(GND) J5.1 J5.M1(MNT) J5.M2(MNT) U17.2(GND) U17.3(IC_ADDR) U18.1(GND) U18.5(SDO) U18.7(GND) U26.2(GND) U26.4(GND) U26.5(GND) U27.4(SA0/SDO) U27.8(FSYNC) U27.9(NC) U27.10(NC) U27.11(NC) U27.12(NC) U27.13(GND) U27.15(RSVD) U28.2(RSVD) U28.3(GND) U28.12(RSVD) U30.5(RES) U30.6(GND) U30.7(GND) U30.8(GND) U31.3(GND)
ACCEL_INT: R111.2 R112.2 R114.2 TP38.1 ; port ACCEL_INT
ALT_INT: NC7.2 NO4.2 NO5.2 R57.2 TP32.1 ; port ALT_INT
SENSE_I2C_SCL: C139.2 D20.2(IO2) J5.4 R58.1 TP41.1 U17.6(SCL) U18.4(SCK) U26.14(SCL/SCLK) U27.2(SCL/SPC) U28.1(SCL/SPC) U30.1(SCL/SPC) U31.4(SCL) ; port SENSE_I2C_SCL
SENSE_I2C_SDA: C140.2 D20.1(IO1) J5.3 R53.1 TP40.1 U17.1(SDA) U18.3(SDI) U26.13(SDA/SDI/SDIO) U27.3(SDA/SDI) U28.11(SDA/SDI/SDO) U30.4(SDA/SDI/SDO) U31.6(SDA) ; port SENSE_I2C_SDA
NetC113_2: C113.2 U28.4(C1)
NetC118_1: C118.1 U27.14(REGOUT)
NetNC7_1: NC7.1 U31.5(INT)
NetNO4_1: NO4.1 U28.7(INT)
NetNO5_1: NO5.1 U27.6(INT)
NetR77_1: R77.1 U17.4(~{RST})
NetR111_1: R111.1 U26.8(INT1)
NetR114_1: R114.1 U30.12(INT1)

Not connected (* = marked no-connect by the designer): D20 4(IO3)* 5(NC)*; U26 3(RSVD)* 9(INT2)* 10(NC)* 11(RSVD)*; U27 7(RSVD)*; U28 8(DRDY)*; U30 11(INT2)*; U31 2(NC)*

### Notes on the sheet
- (near C109) Alternate accelerometer
- Accelerometer,
- temperature sensor
- (near U27) Gyroscope
- I2C address: 0011001
- Humidity, pressure,
- Alternate humidity sensor
- I2C address: 0011101
- I2C address: 1101000
- (near J5) QWIIC interface
- (near J5) SCL
- (near J5) SDA
- (near J5) GND
- (near J5) 3.3V
- (near U18) I2C address: 1110110
- I2C address: 1000000
- (near C135) Ambient light sensor
- Magnetometer
- Light pipe: PLP1-250-F
- I2C address: 0101001
- I2C address: 0011110
- Revision:
- Page:

### Library data of the parts
?#6 = Sub_Title_Block: as ?#5 on sheet C210_0006_Power
C71 C72 C110 C113-C115 C125 C127 C136 C141 = 120-00016: as C45 on sheet C210_0006_Power; Part Number: 120-00016; Revision: 0A; Supplier 1: Digi-Key; Supplier Part Number 1: 490-6297-1-ND; Manufacturer 2: Yageo; Manufacturer P/N 2: CC0402KRX5R6BB104; Supplier 2: Digi-Key; Supplier Part Number 2: 311-1336-1-ND; Arena Link: https://app.bom.com/a/GYHPV2L2L43KRMBK?v=spec.summary; Height: 0.55mm; Pins: 2; Temperature Coefficient: X5R; Voltage: 10V
C109 C112 C116 C124 C126 C135 = 120-00020: as C47 on sheet C210_0006_Power; Part Number: 120-00020; Supplier 1: Digi-Key; Supplier Part Number 1: 1276-1482-1-ND; Manufacturer 2: Yageo; Manufacturer Part Number 2: CC0402KRX5R6BB475; Supplier 2: Digi-Key; Supplier Part Number 2: 311-3477-1-ND; Height: 0.55mm; Max Operating Temp: 85; Min Operating Temp: -55; Pins: 2; Revision: 0C; Temperature Coefficient: X5R; Voltage: 10V
C118 = 120-00072: as C54 on sheet C210_0006_Power; Part Number: 120-00072; Supplier 1: Digi-Key; Supplier Part Number 1: 490-6305-1-ND; Manufacturer 2: Samsung Electro-Mechanics America, Inc; Manufacturer Part Number 2: CL05A474KP5NNNC; Supplier 2: Digi-Key; Supplier Part Number 2: 1276-1173-1-ND; Height: 0.55mm; Max Operating Temp: 85; Min Operating Temp: -55; Pins: 2; Revision: 0A; Temperature Coefficient: X5R; Voltage: 10V
C138-C140 = 120-00047: as C63 on sheet C210_0006_Power; Part Number: 120-00047; Supplier 1: Digi-Key; Supplier Part Number 1: 490-8219-1-ND; Manufacturer 2: AVX Corporation; Manufacturer Part Number 2: 04025A680FAT2A; Supplier 2: Digi-Key; Supplier Part Number 2: 478-7881-1-ND; Height: 0.55mm; Max Operating Temp: 125; Min Operating Temp: -55; Pins: 2; Revision: None; Temperature Coefficient: NP0; Voltage: 50V
D20 = TPD3E001: TVS Diode, ESD High Speed 3-Channel Array, WSON-6, 3mmX3mm; Manufacturer 1: Texas Instruments; Part Name: Diode TVS 5V 3CH WSON-6; Current: None; Item Phase: In Production; MFG Package: WSON-6, DRS (S-PWSON-N6); Use in new designs: Yes; Voltage: 5.5V; Manufacturer Part Number 1: TPD3E001DRSR; Manufacturer 2: None; Manufacturer Part Number 2: None; Supplier 2: None; Supplier Part Number 2: None; Body Size: 3mm x 3mm; Height: 0.80mm; Max Operating Temp: 85; Min Operating Temp: -40; Pins: 6; Revision: 0A; UBX Code: None; Manufacturer P/N: *
J5 = SM04B-SRSS-TB(LF)(SN): Conn, Header, SMD, 1mm Pitch, 4 Pin, R/A, White; Manufacturer 1: JST Sales America Inc.; Part Name: CONN HEADER SMD R/A 4POS 1MM; Item Phase: In Production; Use in new designs: Yes; Voltage: None; Part Number: SM04B-SRSS-TB(LF)(SN); Manufacturer Part Number 1: SM04B-SRSS-TB(LF)(SN); Supplier 1: None; Supplier Part Number 1: None; Diameter: None; Height: 2.9mm; Max Operating Temp: None; Min Operating Temp: None; Pins: 4; Revision: 0A; UBX Code: None; Manufacturer 2: None; Manufacturer Part Number 2: None; Supplier 2: None; Supplier Part Number 2: None; Manufacturer P/N: *
NC7 = Solderbridge-Short: Added By: Paul B; Part Number: Solderbridge-Short; Height: 0; DNP: DNP; Added Date: 12/2/2015
NO4 NO5 = Solderbridge-Open: Added By: Paul B; Part Number: Solderbridge-Open; Height: 0; DNP: DNP; Added Date: 12/2/2015
R53 R58 = 180-00023: Resistor, 2.2Kohm, 1%, 1/16W, 0402; Manufacturer 1: Rohm Semiconductor; Manufacturer Part Number 1: MCR01MRTF2201; Part Name: RES SMD 2.2K OHM 1% 1/16W 0402; Item Phase: In Production; Tolerance: +/- 1%; Use in new designs: Yes; Voltage: None; Part Number: 180-00023; Supplier 1: Digi-Key; Supplier Part Number 1: RHM2.20KCDCT-ND; Manufacturer 2: Yageo; Manufacturer Part Number 2: RC0402FR-072K2L; Supplier 2: Digi-Key; Supplier Part Number 2: 311-2.20KLRCT-ND; Height: 0.4mm; Max Operating Temp: 155; Min Operating Temp: -55; Pins: 2; Power: 1/16W; Revision: 0A; UBX Code: None
R57 R112 = 180-00093: as R50 on sheet C210_0006_Power; Part Number: 180-00093; Supplier 1: Digi-Key; Supplier Part Number 1: 311-100KLRCT-ND; Manufacturer 2: Rohm Semiconductor; Manufacturer Part Number 2: MCR01MRTF1003; Supplier 2: Digi-Key; Supplier Part Number 2: RHM100KCDCT-ND; Height: 0.4mm; Max Operating Temp: 155; Min Operating Temp: -55; Pins: 2; Power: 1/16W; Revision: 0B; UBX Code: None
R77 = 180-00024: as R36 on sheet C210_0006_Power; Part Number: 180-00024; Supplier 1: Digi-Key; Supplier Part Number 1: 1276-3431-1-ND; Manufacturer 2: Hong Kong Resistors Manufactory; Manufacturer Part Number 2: RCT0210KFLF; Supplier 2: None; Supplier Part Number 2: None; Height: 0.4mm; Max Operating Temp: 155; Min Operating Temp: -55; Pins: 2; Power: 1/16W; Revision: 0E; Voltage: N/A
R111 R114 = 180-00020: Resistor 0 ohm 1/16W 0402; Manufacturer 1: Yageo; Manufacturer Part Number 1: RC0402FR-070RL; Part Name: RES SMD 0.0 OHM JUMPER 1/16W 0402; Item Phase: In Production; Tolerance: None; Use in new designs: Yes; Part Number: 180-00020; Supplier 1: Digi-Key; Supplier Part Number 1: 311-0.0LRCT-ND; Manufacturer 2: Hong Kong Resistors Manufactory; Manufacturer Part Number 2: RCT020RLF; Supplier 2: None; Supplier Part Number 2: None; Height: 0.40mm; Max Operating Temp: 155; Min Operating Temp: -55; Pins: 2; Power: 1/16W; Revision: 0E; Voltage: N/A; UBX Code: None
TP32 TP38 TP40 TP41 = TP_R: as TP28-TP31 on sheet C210_0006_Power; Size: 1.0mm; Height: 0; DNP: DNP; Added Date: 2/1/2015; Checked By: Paul B; Checked Date: 2/5/2015
U17 = HTU31: SENSOR, Humidity, I2C, SMT, DFN-6 2.5mmX2.5mm; Manufacturer 1: TE Connectivity; Part Name: B39162B4353P810; Body Size: 1.4mm x 1.1mm; Current: None; Item Phase: In Production; MFG Package: QCS5P; Use in new designs: Yes; Part Number: HTU31; Manufacturer Part Number 1: HTU31; Height: 0.45mm; Max Operating Temp: 85; Min Operating Temp: -40; Pins: 5; Revision: 0A; Voltage: N/A; UBX Code: None
U18 = 250-00039: SENSOR PRESSURE HUMIDITY TEMP; Part_Type: Active Sensor; Manufacturer: Bosch Sensortec; Item_Phase: Pre-Production; Accuracy: ±3%; Body Size: 2.5mm x 2.5mm; Component Mounting Type: SMT; Controller Interface: I2C/SPI; MFG Package: DFN-8; Sensor Range Max: 1100 hPa; Sensor Range Min: 300 hPa; Sensor Type: Humidity/Pressure; SMT Pitch: 0.65mm; Use in new designs: Yes; Voltage: 3.6V; Manufacturer P/N: BME280; Part Number: 250-00039; Part Name: BME280; Revision: 1; Supplier 1: Digi-Key; Supplier Part Number 1: 828-1063-1-ND; Arena Link: https://app.bom.com/a/ASBJPWFWFYX2LZ4C?v=spec.summary; Height: 1mm; Package Type: DFN; Pins: 8
U26 = ADXL345: SENSOR, ACCELEROMETER, 3-AXIS, I2C, SMT, +/-16g, LGA-14 3mmX5mm; Manufacturer 1: Analog Devices; Body Size: 3.0mm x 5.0mm; Current: None; Item Phase: In Production; Use in new designs: Yes; Part Number: ADXL345BCCZ; Manufacturer 2: Analog Devices; Manufacturer Part Number 2: ADXL345BCCZ-RL; Height: 0.45mm; Max Operating Temp: 85; Min Operating Temp: -40; Pins: 14; Revision: 0A; Voltage: N/A; UBX Code: None
U27 = ICG-20330: SENSOR, Gyroscope, I2C, 3-AXIS, 1.7-3.45V, SMT, LGA-16, 3mmX3mm; Manufacturer 1: TDK InvenSense; Part Name: LIS3MDL; Body Size: 2mm x 2mm; Current: None; Item Phase: In Production; MFG Package: LGA-12; Use in new designs: Yes; Voltage: 1.9-3.6V; Part Number: ICG-20330; Manufacturer Part Number 1: ICG-20330; Height: 1mm; Max Operating Temp: 85; Min Operating Temp: -40; Pins: 12; Revision: 0A; UBX Code: None
U28 = LIS3MDL: SENSOR, MAGNETOMETER, I2C, 3-AXIS, 1.9-3.6V, SMT, LGA-12, 2mmX2mm; Manufacturer 1: ST Micro; Current: None; Item Phase: In Production; Use in new designs: Yes; Part Number: LIS3MDL; Manufacturer Part Number 1: LIS3MDL; Body Size: 2mm x 2mm; Height: 1mm; MFG Package: LGA-12; Max Operating Temp: 85; Min Operating Temp: -40; Part Name: LIS3MDL; Pins: 12; Revision: 0A; Voltage: 1.9-3.6V; UBX Code: None
U30 = 250-00008: Accelerometer, 2G-16G Max, 12bit, LGA-12; Part_Type: Active Sensor; Manufacturer: STMicroelectronics; Item_Phase: Production; Accuracy: 1mg/digit; Bit Resolution: 12; Body Size: 2mm x 2mm; Component Mounting Type: SMT; Controller Interface: I2C/SPI; MFG Package: 12-LGA (2x2); Sensor Range Max: +/-16g; Sensor Range Min: +/-2g; SMT Pitch: 0.5mm; Use in new designs: Yes; Voltage: 3.6V; Part Number: 250-00008; Part Name: LIS2DH12; Revision: 0A; Supplier 1: Digi-Key; Supplier Part Number 1: 497-14851-1-ND; Arena Link: https://app.bom.com/a/I0JRX4N4N65KM89I?v=spec.summary; Height: 1mm; Package Type: LGA; Pins: 12; Sensor Type: Accelerometer
U31 = LTR-303ALS-01: SENSOR, AMBIENT LIGHT, I2C, SMT, GNSS, DFN-6 2mmX2mm; Manufacturer 1: Lite-On; Part Name: B39162B4353P810; Body Size: 1.4mm x 1.1mm; Current: None; Item Phase: In Production; MFG Package: QCS5P; Use in new designs: Yes; Part Number: LTR-303ALS-01; Manufacturer Part Number 1: LTR-303ALS-01; Height: 0.45mm; Max Operating Temp: 85; Min Operating Temp: -40; Pins: 5; Revision: 0A; Voltage: N/A; UBX Code: None